# Altium schematic sheet Mobo.SchDoc
size A4
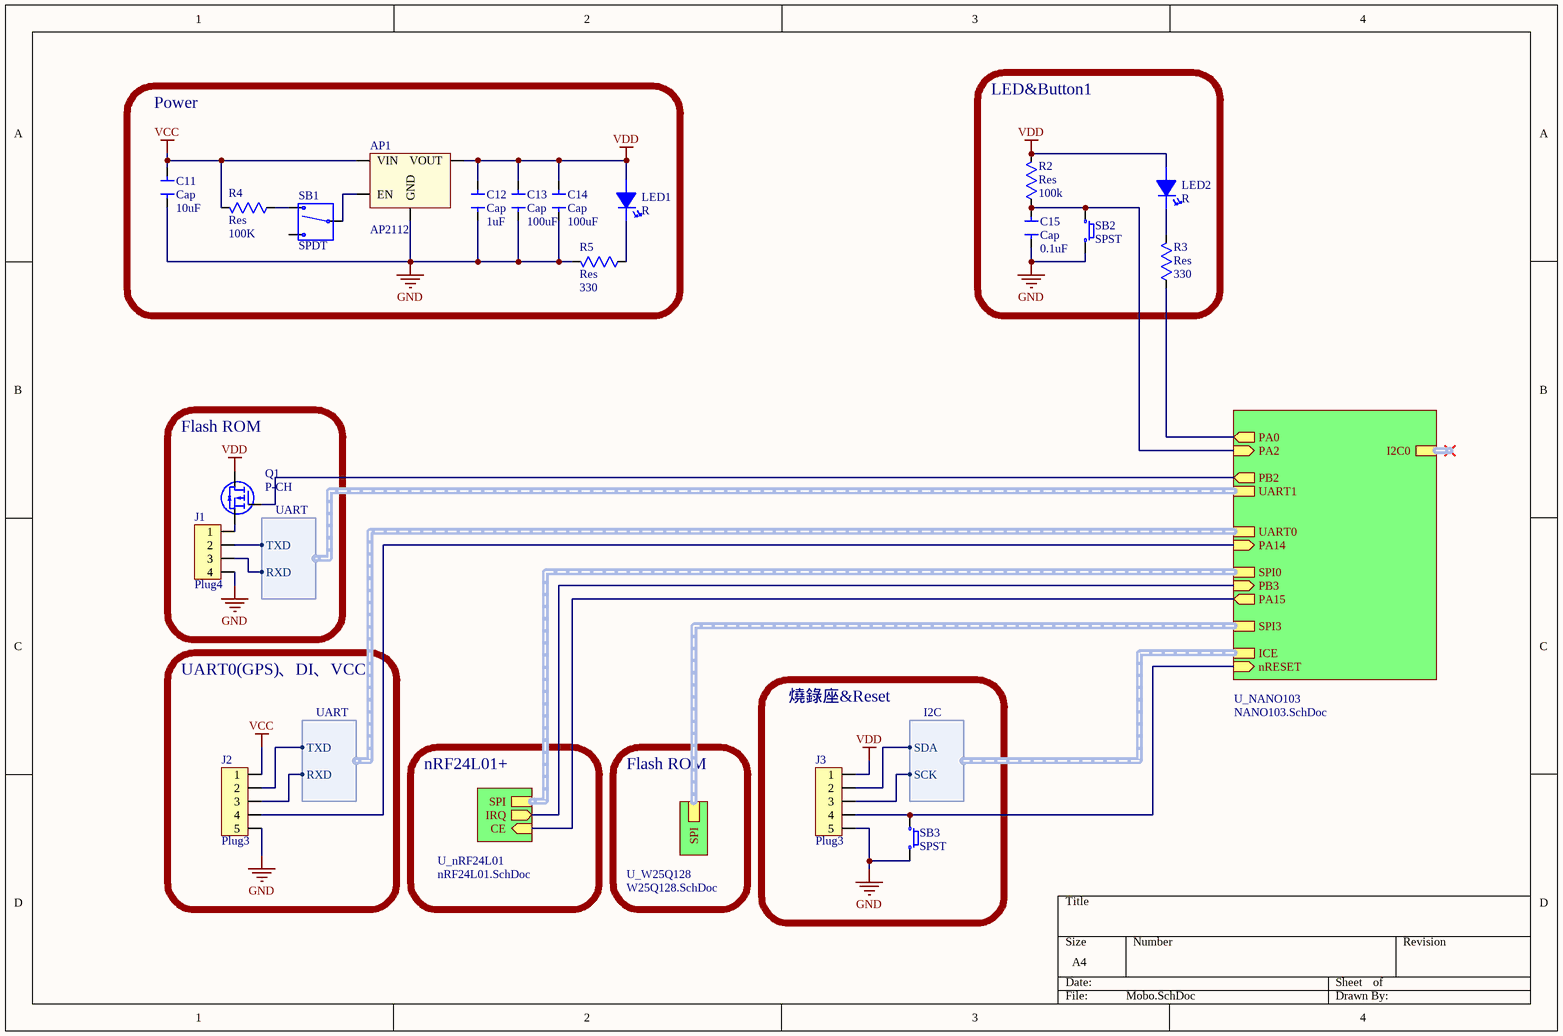
[diagram p0: Mobo.SchDoc]

## Parts
AP1  AP2112  [SOT-23-5]
C11  Cap  value 10uF  [Cap_0603]
C12  Cap  value 1uF  [Cap_0603]
C13  Cap  value 100uF  [CAP_1206]
C14  Cap  value 100uF  [CAP_1206]
C15  Cap  value 0.1uF  [Cap_0603]
J1  Plug4  [JST_2.0mm_4pin_180]
J2  Plug3  [GH_1.25mm_Thru_5pin]
J3  Plug3  [GH_1.25mm_Thru_5pin]
LED1  R  [SMD-0603_LED]
LED2  R  [SMD-0603_LED]
Q1  Polarity: P-CH  [SOT-23]  (hidden comment: SI2301DS-T1)
R2  Res  value 100k  [RES_0603]
R3  Res  value 330  [RES_0603]
R4  Res  value 100K  [RES_0603]
R5  Res  value 330  [RES_0603]
SB1  SPDT  [SS-SK-02P]
SB2  SPST  [TACK-SW_SMD 2P 4x3mm_2]
SB3  SPST  [TACK-SW_SMD 2P 4x3mm_2]

## Blocks framed on the sheet
Power: AP1 C11-C14 LED1 R4 R5 SB1
LED&Button1: C15 LED2 R2 R3 SB2
Flash ROM: J1 Q1
UART0(GPS)、DI、VCC: J2
燒錄座&Reset: J3 SB3

## Sub-sheets
U_NANO103 = NANO103.SchDoc: SPI3 (harness SPI), UART1 (harness UART), I2C0 (harness I2C), nRESET (in), PB3 (in), PA14 (in), PA15 (out), PA2 (in), PA0 (out), ICE (harness I2C), SPI0 (harness SPI), PB2 (out), UART0 (harness UART)
U_nRF24L01 = nRF24L01.SchDoc: SPI (harness SPI), CE (in), IRQ (out)
U_W25Q128 = W25Q128.SchDoc: SPI (harness SPI)

## Harnesses
UART: TXD, RXD
I2C: SCK, SDA

## Nets
GND: AP1.2(GND) C11.2 C12.2 C13.2 C14.2 C15.1 J1.4 J2.5 J3.5 R5.1 SB2.1 SB3.2
VCC: AP1.1(VIN) C11.1 J2.1 R4.1
VDD: AP1.5(VOUT) C12.1 C13.1 C14.1 J3.1 LED1.1 LED2.1 Q1.1 R2.1
NetAP1_3: AP1.3(EN) SB1.2
NetC15_2: C15.2 R2.2 SB2.2 ; sheet U_NANO103/PA2
NetJ1_1: J1.1 Q1.3
NetJ1_2: J1.2 ; sheet U_NANO103/UART1.TXD
NetJ1_3: J1.3 ; sheet U_NANO103/UART1.RXD
NetJ2_2: J2.2 ; sheet U_NANO103/UART0.TXD
NetJ2_3: J2.3 ; sheet U_NANO103/UART0.RXD
NetJ2_4: J2.4 ; sheet U_NANO103/PA14
NetJ3_2: J3.2 ; sheet U_NANO103/ICE.SDA
NetJ3_3: J3.3 ; sheet U_NANO103/ICE.SCK
NetJ3_4: J3.4 SB3.1 ; sheet U_NANO103/nRESET
NetLED1_2: LED1.2 R5.2
NetLED2_2: LED2.2 R3.1
NetQ1_2: Q1.2 ; sheet U_NANO103/PB2
NetR3_2: R3.2 ; sheet U_NANO103/PA0
NetR4_2: R4.2 SB1.3
(unnamed): sheet U_nRF24L01/CE, sheet U_NANO103/PA15
(unnamed): sheet U_nRF24L01/IRQ, sheet U_NANO103/PB3

Not connected (* = marked no-connect by the designer): SB1 1

## Buses and harness runs
harness sheet U_NANO103/SPI0 = sheet U_nRF24L01/SPI
harness sheet U_NANO103/SPI3 = sheet U_W25Q128/SPI

## Notes on the sheet
- nRF24L01+
- Flash ROM

## Library data of the parts
J2 J3 = Plug5
LED1 LED2 = LED
Q1 = SI2301DS-T1: Trans MOSFET P-CH 20V 2.3A 3-Pin TO-236 T/R; pin to pad: 1>2 2>1; Manufacturer: Vishay Siliconix; Rise Time: 36ns; Drain to Source Resistance: 130mR; Gate to Source Voltage (Vgs): 8V; Max Power Dissipation: 1.25W; Turn-Off Delay Time: 42ns; Turn-On Delay Time: 13ns; Number of Elements: 1; Element Configuration: Single; Drain to Source Voltage (Vdss): -20V; Supplier 1: Component Sense; Manufacturer Part Number: SI2301DS-T1; RoHS: No; Category: MOSFETs; Stock 1: 12531; Pricing 1: 143=0.17500, 500=0.15000, 1000=0.10000, 5000=0.09000, 10000=0.08000 (USD); Mount: Surface Mount; Case/Package: SOT-23-3; Number of Pins: 3; Weight: 0.050717oz; Min Operating Temperature: -55°C; Max Operating Temperature: 150°C; Packaging: Tape and Reel; Package Quantity: 3000; Continuous Drain Current (ID): 2.3A; Fall Time: 36ns; Power Dissipation: 1.25W; Number of Channels: 1; Length: 3.04mm; Height: 1.02mm; Width: 1.4mm; ComponentLink1URL: https://datasheet.ciiva.com/13048/70627-115154-13048148.pdf?src-supplier=Mouser; ComponentLink1Description: https://datasheet.ciiva.com/13048/70627-115154-13048148.pdf?src-supplier=Mouser; Supplier Part Number 1: SI2301DS-T1
SB1 = Switch_Button2
SB2 SB3 = Switch_Button1